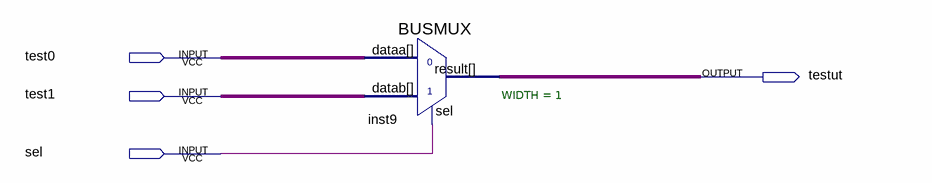
[diagram p0: schematic sheet]
// Quartus schematic testmux.bdf as structural Verilog: 1 symbols, 4 pins
module testmux (
  input  test0,
  input  test1,
  input  sel,
  output testut
);

  BUSMUX #(.WIDTH(1)) inst9 (.datab(test1), .sel(sel), .dataa(test0), .result(testut));
endmodule
